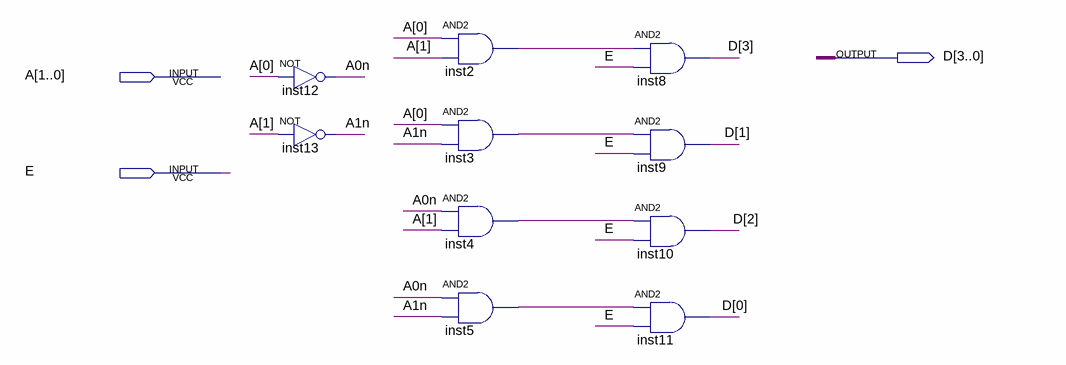
[diagram p0: schematic sheet]
// Quartus schematic decoder_2_4.bdf as structural Verilog: 10 symbols, 3 pins
module decoder_2_4 (
  input  [1:0] A,
  input  E,
  output [3:0] D
);

  wire A0n, A1n, inst2_out, inst3_out, inst4_out, inst5_out;

  not inst12 (A0n, A[0]);
  not inst13 (A1n, A[1]);
  and inst2 (inst2_out, A[0], A[1]);
  and inst3 (inst3_out, A[0], A1n);
  and inst4 (inst4_out, A0n, A[1]);
  and inst5 (inst5_out, A0n, A1n);
  and inst8 (D[3], inst2_out, E);
  and inst9 (D[1], inst3_out, E);
  and inst10 (D[2], inst4_out, E);
  and inst11 (D[0], inst5_out, E);
endmodule
